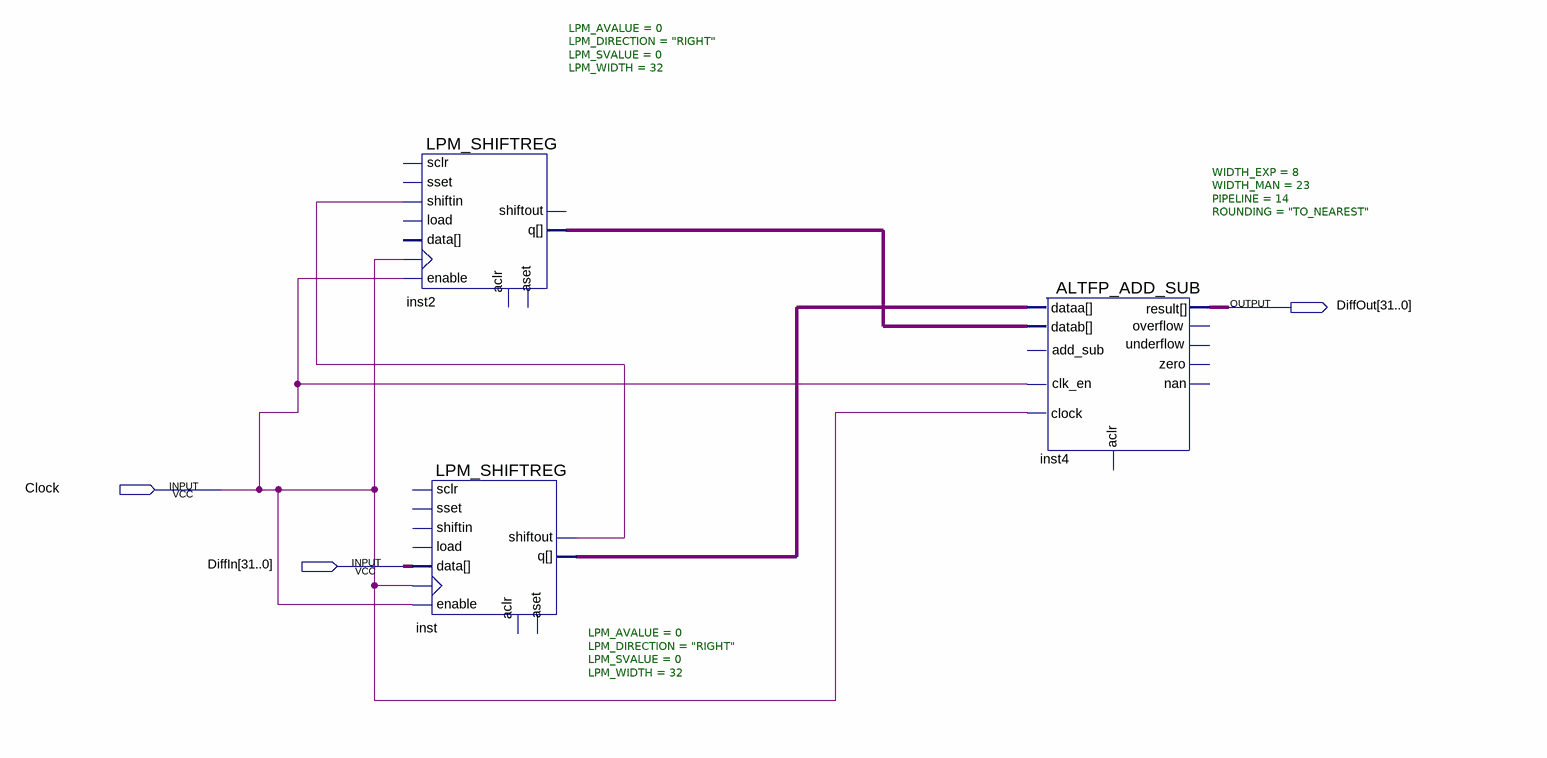
[diagram p0: schematic sheet]
// Quartus schematic TEST.bdf as structural Verilog: 3 symbols, 3 pins
module TEST (
  input  Clock,
  input  [31:0] DiffIn,
  output [31:0] DiffOut
);

  wire inst_shiftout;
  wire [31:0] inst2_q, inst_q;

  LPM_SHIFTREG #(.LPM_AVALUE(0), .LPM_DIRECTION("RIGHT"), .LPM_SVALUE(0), .LPM_WIDTH(32)) inst2 (
    .shiftin(inst_shiftout), .enable(Clock), .clock(Clock), .q(inst2_q));  // open: sset, data, load, sclr, aset, aclr, shiftout
  LPM_SHIFTREG #(.LPM_AVALUE(0), .LPM_DIRECTION("RIGHT"), .LPM_SVALUE(0), .LPM_WIDTH(32)) inst (
    .enable(Clock), .clock(Clock), .data(DiffIn), .shiftout(inst_shiftout), .q(inst_q));  // open: shiftin, sset, load, sclr, aset, aclr
  ALTFP_ADD_SUB #(.WIDTH_EXP(8), .WIDTH_MAN(23), .PIPELINE(14), .ROUNDING("TO_NEAREST")) inst4 (
    .dataa(inst_q), .datab(inst2_q), .clk_en(Clock), .clock(Clock), .result(DiffOut));  // open: aclr, add_sub, overflow, underflow, zero, nan
endmodule
